# EAGLE schematic board (EAGLE 6.2)
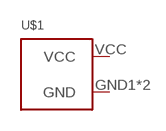
[diagram p0: schematic, sheet 1]

## Parts
U$1  GBP_POWER_JACK  [GBP_POWER_JACK]
Unconnected: U$1.GND1(GND) U$1.GND2(GND)

## Power pins joined to a net without a drawn wire
VCC: U$1.VCC

## Library data of the parts
U$1 = ,giltesa:GBP_POWER_JACK